# EAGLE schematic FilterSchematic_REV3 (EAGLE 8.2.2)
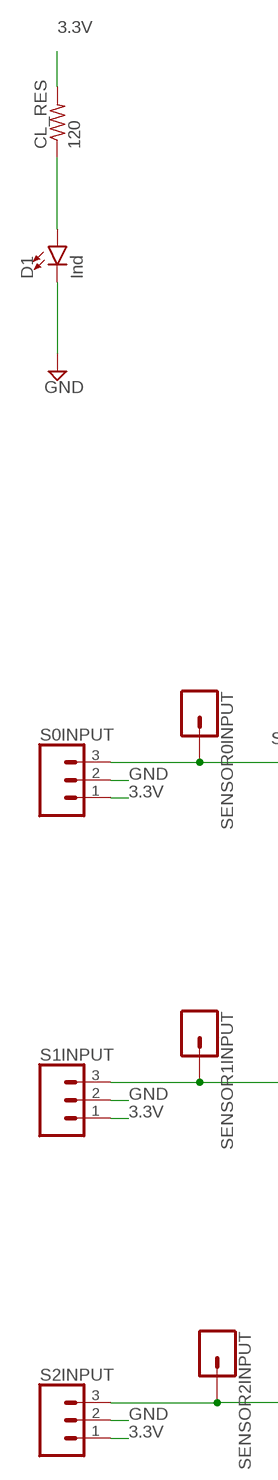
[diagram p0: schematic, sheet 1, part 1 of 2]
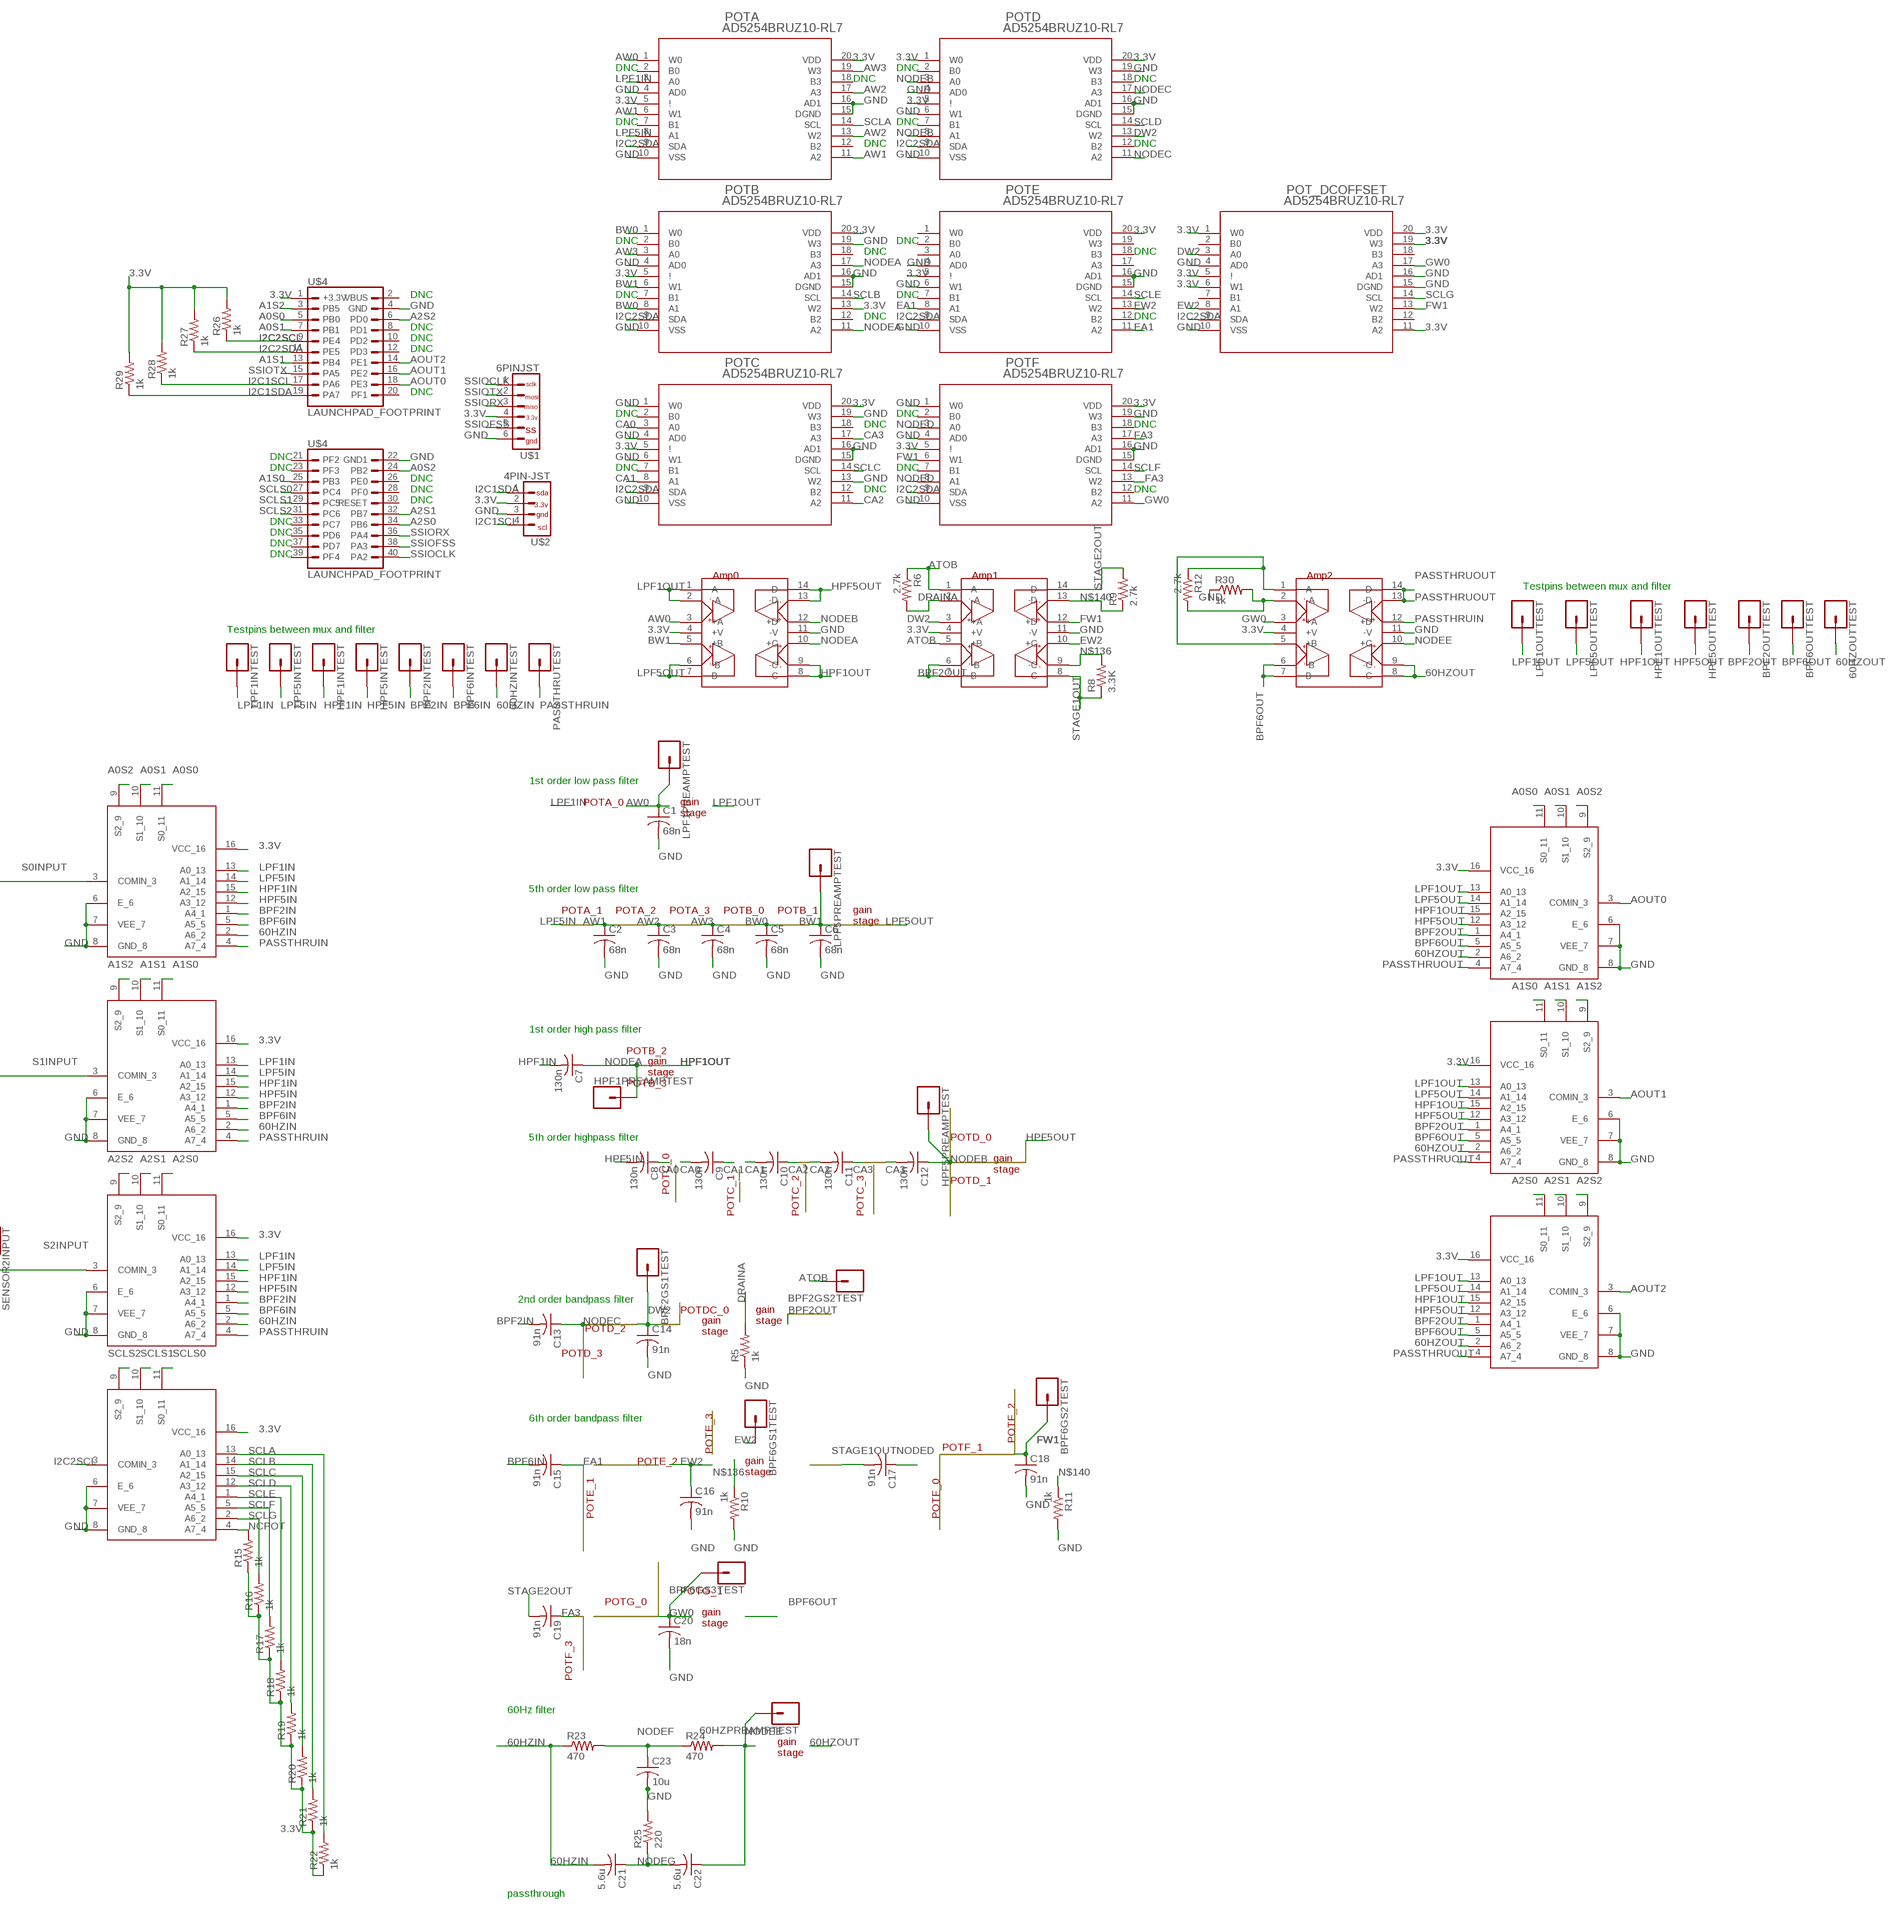
[diagram p1: schematic, sheet 1, part 2 of 2]

## Parts
60HZINTEST  CONN_01  [1X01]
60HZOUTTEST  CONN_01  [1X01]
60HZPREAMPTEST  CONN_01  [1X01]
A2IDEMUX  CD74HC4051-Q1  [TSSOP16]
AI0DEMUX  CD74HC4051-Q1  [TSSOP16]
AI1DEMUX  CD74HC4051-Q1  [TSSOP16]
AMP0  OPA4830  [TSSOP14]
AMP1  OPA4830  [TSSOP14]
AMP2  OPA4830  [TSSOP14]
AO0MUX  CD74HC4051-Q1  [TSSOP16]
AO1MUX  CD74HC4051-Q1  [TSSOP16]
AO2MUX  CD74HC4051-Q1  [TSSOP16]
BPF2GS1TEST  CONN_01  [1X01]
BPF2GS2TEST  CONN_01  [1X01]
BPF2INTEST  CONN_01  [1X01]
BPF2OUTTEST  CONN_01  [1X01]
BPF6GS1TEST  CONN_01  [1X01]
BPF6GS2TEST  CONN_01  [1X01]
BPF6GS3TEST  CONN_01  [1X01]
BPF6INTEST  CONN_01  [1X01]
BPF6OUTTEST  CONN_01  [1X01]
C1  68n  C-USC0805  [C0805]
C2  68n  C-USC0805  [C0805]
C3  68n  C-USC0805  [C0805]
C4  68n  C-USC0805  [C0805]
C5  68n  C-USC0805  [C0805]
C6  68n  C-USC0805  [C0805]
C7  130n  C-USC0805  [C0805]
C8  130n  C-USC0805  [C0805]
C9  130n  C-USC0805  [C0805]
C10  130n  C-USC0805  [C0805]
C11  130n  C-USC0805  [C0805]
C12  130n  C-USC0805  [C0805]
C13  91n  C-USC0805  [C0805]
C14  91n  C-USC0805  [C0805]
C15  91n  C-USC0805  [C0805]
C16  91n  C-USC0805  [C0805]
C17  91n  C-USC0805  [C0805]
C18  91n  C-USC0805  [C0805]
C19  91n  C-USC0805  [C0805]
C20  18n  C-USC0805  [C0805]
C21  5.6u  C-USC0805  [C0805]
C22  5.6u  C-USC0805  [C0805]
C23  10u  C-USC0805  [C0805]
CL_RES  120  R-US_R0805  [R0805]
D1  Ind  LED-GREEN0603  [LED-0603]
HPF1INTEST  CONN_01  [1X01]
HPF1OUTTEST  CONN_01  [1X01]
HPF1PREAMPTEST  CONN_01  [1X01]
HPF5INTEST  CONN_01  [1X01]
HPF5OUTTEST  CONN_01  [1X01]
HPF5PREAMPTEST  CONN_01  [1X01]
LPF1INTEST  CONN_01  [1X01]
LPF1OUTTEST  CONN_01  [1X01]
LPF1PREAMPTEST  CONN_01  [1X01]
LPF5INTEST  CONN_01  [1X01]
LPF5OUTTEST  CONN_01  [1X01]
LPF5PREAMPTEST  CONN_01  [1X01]
PASSTHRUTEST  CONN_01  [1X01]
POT_DCOFFSET  AD5254BRUZ10-RL7  [RU_20]
POTA  AD5254BRUZ10-RL7  [RU_20]
POTB  AD5254BRUZ10-RL7  [RU_20]
POTC  AD5254BRUZ10-RL7  [RU_20]
POTD  AD5254BRUZ10-RL7  [RU_20]
POTE  AD5254BRUZ10-RL7  [RU_20]
POTF  AD5254BRUZ10-RL7  [RU_20]
R5  1k  R-US_R0805  [R0805]
R6  2.7k  R-US_R0805  [R0805]
R8  3.3K  R-US_R0805  [R0805]
R9  2.7k  R-US_R0805  [R0805]
R10  1k  R-US_R0805  [R0805]
R11  1k  R-US_R0805  [R0805]
R12  2.7k  R-US_R0805  [R0805]
R15  1k  R-US_R0805  [R0805]
R16  1k  R-US_R0805  [R0805]
R17  1k  R-US_R0805  [R0805]
R18  1k  R-US_R0805  [R0805]
R19  1k  R-US_R0805  [R0805]
R20  1k  R-US_R0805  [R0805]
R21  1k  R-US_R0805  [R0805]
R22  1k  R-US_R0805  [R0805]
R23  470  R-US_R0805  [R0805]
R24  470  R-US_R0805  [R0805]
R25  220  R-US_R0805  [R0805]
R26  1k  R-US_R0805  [R0805]
R27  1k  R-US_R0805  [R0805]
R28  1k  R-US_R0805  [R0805]
R29  1k  R-US_R0805  [R0805]
R30  1k  R-US_R0805  [R0805]
S0INPUT  CONN_03JST-PTH-VERT  [JST-3-PTH-VERT]
S1INPUT  CONN_03JST-PTH-VERT  [JST-3-PTH-VERT]
S2INPUT  CONN_03JST-PTH-VERT  [JST-3-PTH-VERT]
SCLMUX  CD74HC4051-Q1  [TSSOP16]
SENSOR0INPUT  CONN_01  [1X01]
SENSOR1INPUT  CONN_01  [1X01]
SENSOR2INPUT  CONN_01  [1X01]
U$1  6PINJST  [JST-6-PTH-VERT]
U$2  4PIN-JST  [JST-4-PTH-VERT]
U$4  LAUNCHPAD_FOOTPRINT  [SSW-110-02-S-D]

## Nets
3.3V: A2IDEMUX.16(VCC_16) AI0DEMUX.16(VCC_16) AI1DEMUX.16(VCC_16) AMP0.4(+V) AMP1.4(+V) AMP2.4(+V) AO0MUX.16(VCC_16) AO1MUX.16(VCC_16) AO2MUX.16(VCC_16) CL_RES.2 POT_DCOFFSET.1(W0) POT_DCOFFSET.5(!) POT_DCOFFSET.6(W1) POT_DCOFFSET.11(A2) POT_DCOFFSET.19(W3) POT_DCOFFSET.20(VDD) POTA.5(!) POTA.20(VDD) POTB.5(!) POTB.13(W2) POTB.20(VDD) POTC.5(!) POTC.20(VDD) POTD.1(W0) POTD.5(!) POTD.20(VDD) POTE.5(!) POTE.20(VDD) POTF.5(!) POTF.20(VDD) R15.1 R16.1 R17.1 R18.1 R19.1 R20.1 R21.1 R22.1 R26.2 R27.2 R28.2 R29.2 S0INPUT.1 S1INPUT.1 S2INPUT.1 SCLMUX.16(VCC_16) U$1.4 U$2.2 U$4.1(+3.3V)
60HZIN: 60HZINTEST.1 A2IDEMUX.2(A6_2) AI0DEMUX.2(A6_2) AI1DEMUX.2(A6_2) C21.2 R23.1
60HZOUT: 60HZOUTTEST.1 AMP2.8(C) AMP2.9(-C) AO0MUX.2(A6_2) AO1MUX.2(A6_2) AO2MUX.2(A6_2)
A0S0: AI0DEMUX.11(S0_11) AO0MUX.11(S0_11) U$4.5(PB0)
A0S1: AI0DEMUX.10(S1_10) AO0MUX.10(S1_10) U$4.7(PB1)
A0S2: AI0DEMUX.9(S2_9) AO0MUX.9(S2_9) U$4.24(PB2)
A1S0: AI1DEMUX.11(S0_11) AO1MUX.11(S0_11) U$4.25(PB3)
A1S1: AI1DEMUX.10(S1_10) AO1MUX.10(S1_10) U$4.13(PB4)
A1S2: AI1DEMUX.9(S2_9) AO1MUX.9(S2_9) U$4.3(PB5)
A2S0: A2IDEMUX.11(S0_11) AO2MUX.11(S0_11) U$4.34(PB6)
A2S1: A2IDEMUX.10(S1_10) AO2MUX.10(S1_10) U$4.32(PB7)
A2S2: A2IDEMUX.9(S2_9) AO2MUX.9(S2_9) U$4.6(PD0)
AOUT0: AO0MUX.3(COMIN_3) U$4.18(PE3)
AOUT1: AO1MUX.3(COMIN_3) U$4.16(PE2)
AOUT2: AO2MUX.3(COMIN_3) U$4.14(PE1)
ATOB: AMP1.1(A) AMP1.5(+B) BPF2GS2TEST.1 R6.1
AW0: AMP0.3(+A) C1.1 LPF1PREAMPTEST.1 POTA.1(W0)
AW1: C2.1 POTA.6(W1) POTA.11(A2)
AW2: C3.1 POTA.13(W2) POTA.17(A3)
AW3: C4.1 POTA.19(W3) POTB.3(A0)
BPF2IN: A2IDEMUX.1(A4_1) AI0DEMUX.1(A4_1) AI1DEMUX.1(A4_1) BPF2INTEST.1 C13.2
BPF2OUT: AMP1.6(-B) AMP1.7(B) AO0MUX.1(A4_1) AO1MUX.1(A4_1) AO2MUX.1(A4_1) BPF2OUTTEST.1
BPF6IN: A2IDEMUX.5(A5_5) AI0DEMUX.5(A5_5) AI1DEMUX.5(A5_5) BPF6INTEST.1 C15.2
BPF6OUT: AMP2.6(-B) AMP2.7(B) AO0MUX.5(A5_5) AO1MUX.5(A5_5) AO2MUX.5(A5_5) BPF6OUTTEST.1
BW0: C5.1 POTB.1(W0) POTB.8(A1)
BW1: AMP0.5(+B) C6.1 LPF5PREAMPTEST.1 POTB.6(W1)
CA0: C8.1 C9.2 POTC.3(A0)
CA1: C9.1 C10.2 POTC.8(A1)
CA2: C10.1 C11.2 POTC.11(A2)
CA3: C11.1 C12.2 POTC.17(A3)
DRAINA: AMP1.2(-A) R5.2 R6.2
DW2: AMP1.3(+A) BPF2GS1TEST.1 C14.1 POT_DCOFFSET.3(A0) POTD.13(W2)
EA1: C15.1 POTE.8(A1) POTE.11(A2)
EW2: AMP1.10(+C) BPF6GS1TEST.1 C16.1 POT_DCOFFSET.8(A1) POTE.13(W2)
FA3: C19.1 POTF.13(W2) POTF.17(A3)
FW1: AMP1.12(+D) BPF6GS2TEST.1 C18.1 POT_DCOFFSET.13(W2) POTF.6(W1)
GND: A2IDEMUX.6(E_6) A2IDEMUX.7(VEE_7) A2IDEMUX.8(GND_8) AI0DEMUX.6(E_6) AI0DEMUX.7(VEE_7) AI0DEMUX.8(GND_8) AI1DEMUX.6(E_6) AI1DEMUX.7(VEE_7) AI1DEMUX.8(GND_8) AMP0.11(-V) AMP1.11(-V) AMP2.11(-V) AO0MUX.6(E_6) AO0MUX.7(VEE_7) AO0MUX.8(GND_8) AO1MUX.6(E_6) AO1MUX.7(VEE_7) AO1MUX.8(GND_8) AO2MUX.6(E_6) AO2MUX.7(VEE_7) AO2MUX.8(GND_8) C1.2 C2.2 C3.2 C4.2 C5.2 C6.2 C14.2 C16.2 C18.2 C20.2 C23.2 D1.C POT_DCOFFSET.4(AD0) POT_DCOFFSET.10(VSS) POT_DCOFFSET.15(DGND) POT_DCOFFSET.16(AD1) POTA.4(AD0) POTA.10(VSS) POTA.15(DGND) POTA.16(AD1) POTB.4(AD0) POTB.10(VSS) POTB.15(DGND) POTB.16(AD1) POTB.19(W3) POTC.1(W0) POTC.4(AD0) POTC.6(W1) POTC.10(VSS) POTC.13(W2) POTC.15(DGND) POTC.16(AD1) POTC.19(W3) POTD.4(AD0) POTD.6(W1) POTD.10(VSS) POTD.15(DGND) POTD.16(AD1) POTD.19(W3) POTE.4(AD0) POTE.6(W1) POTE.10(VSS) POTE.15(DGND) POTE.16(AD1) POTF.1(W0) POTF.4(AD0) POTF.10(VSS) POTF.15(DGND) POTF.16(AD1) POTF.19(W3) R5.1 R10.2 R11.2 R25.2 R30.1 S0INPUT.2 S1INPUT.2 S2INPUT.2 SCLMUX.6(E_6) SCLMUX.7(VEE_7) SCLMUX.8(GND_8) U$1.6 U$2.3 U$4.4(GND) U$4.22(GND1)
GW0: AMP2.3(+A) BPF6GS3TEST.1 C20.1 POT_DCOFFSET.17(A3) POTF.11(A2)
HPF1IN: A2IDEMUX.15(A2_15) AI0DEMUX.15(A2_15) AI1DEMUX.15(A2_15) C7.2 HPF1INTEST.1
HPF1OUT: AMP0.8(C) AMP0.9(-C) AO0MUX.15(A2_15) AO1MUX.15(A2_15) AO2MUX.15(A2_15) HPF1OUTTEST.1
HPF5IN: A2IDEMUX.12(A3_12) AI0DEMUX.12(A3_12) AI1DEMUX.12(A3_12) C8.2 HPF5INTEST.1
HPF5OUT: AMP0.13(-D) AMP0.14(D) AO0MUX.12(A3_12) AO1MUX.12(A3_12) AO2MUX.12(A3_12) HPF5OUTTEST.1
I2C1SCL: R28.1 U$2.4 U$4.17(PA6)
I2C1SDA: R29.1 U$2.1 U$4.19(PA7)
I2C2SCL: R26.1 SCLMUX.3(COMIN_3) U$4.9(PE4)
I2C2SDA: POT_DCOFFSET.9(SDA) POTA.9(SDA) POTB.9(SDA) POTC.9(SDA) POTD.9(SDA) POTE.9(SDA) POTF.9(SDA) R27.1 U$4.11(PE5)
LPF1IN: A2IDEMUX.13(A0_13) AI0DEMUX.13(A0_13) AI1DEMUX.13(A0_13) LPF1INTEST.1 POTA.3(A0)
LPF1OUT: AMP0.1(A) AMP0.2(-A) AO0MUX.13(A0_13) AO1MUX.13(A0_13) AO2MUX.13(A0_13) LPF1OUTTEST.1
LPF5IN: A2IDEMUX.14(A1_14) AI0DEMUX.14(A1_14) AI1DEMUX.14(A1_14) LPF5INTEST.1 POTA.8(A1)
LPF5OUT: AMP0.6(-B) AMP0.7(B) AO0MUX.14(A1_14) AO1MUX.14(A1_14) AO2MUX.14(A1_14) LPF5OUTTEST.1
N$1: CL_RES.1 D1.A
N$136: AMP1.9(-C) R8.2 R10.1
N$140: AMP1.13(-D) R9.1 R11.1
N$142: AMP2.1(A) AMP2.5(+B) R12.1
N$143: AMP2.2(-A) R12.2 R30.2
NCPOT: R15.2 SCLMUX.4(A7_4)
NODEA: AMP0.10(+C) C7.1 HPF1PREAMPTEST.1 POTB.11(A2) POTB.17(A3)
NODEB: AMP0.12(+D) C12.1 HPF5PREAMPTEST.1 POTD.3(A0) POTD.8(A1)
NODEC: C13.1 POTD.11(A2) POTD.17(A3)
NODED: C17.1 POTF.3(A0) POTF.8(A1)
NODEE: 60HZPREAMPTEST.1 AMP2.10(+C) C22.1 R24.2
NODEF: C23.1 R23.2 R24.1
NODEG: C21.1 C22.2 R25.1
PASSTHRUIN: A2IDEMUX.4(A7_4) AI0DEMUX.4(A7_4) AI1DEMUX.4(A7_4) AMP2.12(+D) PASSTHRUTEST.1
PASSTHRUOUT: AMP2.13(-D) AMP2.14(D) AO0MUX.4(A7_4) AO1MUX.4(A7_4) AO2MUX.4(A7_4)
S0INPUT: AI0DEMUX.3(COMIN_3) S0INPUT.3 SENSOR0INPUT.1
S1INPUT: AI1DEMUX.3(COMIN_3) S1INPUT.3 SENSOR1INPUT.1
S2INPUT: A2IDEMUX.3(COMIN_3) S2INPUT.3 SENSOR2INPUT.1
SCLA: POTA.14(SCL) R22.2 SCLMUX.13(A0_13)
SCLB: POTB.14(SCL) R21.2 SCLMUX.14(A1_14)
SCLC: POTC.14(SCL) R20.2 SCLMUX.15(A2_15)
SCLD: POTD.14(SCL) R19.2 SCLMUX.12(A3_12)
SCLE: POTE.14(SCL) R18.2 SCLMUX.1(A4_1)
SCLF: POTF.14(SCL) R17.2 SCLMUX.5(A5_5)
SCLG: POT_DCOFFSET.14(SCL) R16.2 SCLMUX.2(A6_2)
SCLS0: SCLMUX.11(S0_11) U$4.27(PC4)
SCLS1: SCLMUX.10(S1_10) U$4.29(PC5)
SCLS2: SCLMUX.9(S2_9) U$4.31(PC6)
SSIOCLK: U$1.1 U$4.40(PA2)
SSIOFSS: U$1.5 U$4.38(PA3)
SSIORX: U$1.3 U$4.36(PA4)
SSIOTX: U$1.2 U$4.15(PA5)
STAGE1OUT: AMP1.8(C) C17.2 R8.1
STAGE2OUT: AMP1.14(D) C19.2 R9.2
Unconnected: POT_DCOFFSET.2(B0) POT_DCOFFSET.7(B1) POT_DCOFFSET.12(B2) POT_DCOFFSET.18(B3) POTA.2(B0) POTA.7(B1) POTA.12(B2) POTA.18(B3) POTB.2(B0) POTB.7(B1) POTB.12(B2) POTB.18(B3) POTC.2(B0) POTC.7(B1) POTC.12(B2) POTC.18(B3) POTD.2(B0) POTD.7(B1) POTD.12(B2) POTD.18(B3) POTE.1(W0) POTE.2(B0) POTE.3(A0) POTE.7(B1) POTE.12(B2) POTE.17(A3) POTE.18(B3) POTE.19(W3) POTF.2(B0) POTF.7(B1) POTF.12(B2) POTF.18(B3) U$4.2(VBUS) U$4.8(PD1) U$4.10(PD2) U$4.12(PD3) U$4.20(PF1) U$4.21(PF2) U$4.23(PF3) U$4.26(PE0) U$4.28(PF0) U$4.30(RESET) U$4.33(PC7) U$4.35(PD6) U$4.37(PD7) U$4.39(PF4)

## Notes on the sheet
- DNC | DNC
- DNC | DNC
- DNC | DNC
- DNC | DNC
- DNC | DNC
- DNC | DNC
- DNC | DNC | DNC
- DNC | DNC
- DNC
- DNC
- DNC
- DNC
- DNC | DNC
- DNC | DNC
- DNC
- DNC | DNC | DNC
- DNC
- DNC | DNC | DNC
- DNC
- DNC
- DNC
- DNC
- DNC
- Amp0 | Amp1 | Amp2
- Testpins between mux and filter
- Testpins between mux and filter
- 1st order low pass filter
- POTA_0
- gain
  stage
- 5th order low pass filter
- POTA_1 | POTA_2 | POTA_3 | POTB_0 | POTB_1
- gain
  stage
- 1st order high pass filter
- POTB_2
- gain
  stage
- POTB_3
- 5th order highpass filter | POTD_0
- gain
  stage
- POTD_1
- POTC_0
- POTC_1 | POTC_2 | POTC_3
- 2nd order bandpass filter
- POTDC_0
- POTD_2
- gain
  stage
- gain
  stage
- POTD_3
- 6th order bandpass filter
- POTF_1 | POTF_2
- POTE_3
- POTE_2
- gain
  stage
- POTE_1 | POTF_0
- POTG_1
- POTG_0
- gain
  stage
- POTF_3
- 60Hz filter
- gain
  stage
- passthrough

## Library data of the parts
60HZINTEST 60HZOUTTEST 60HZPREAMPTEST BPF2GS1TEST BPF2GS2TEST BPF2INTEST BPF2OUTTEST BPF6GS1TEST BPF6GS2TEST BPF6GS3TEST BPF6INTEST BPF6OUTTEST HPF1INTEST HPF1OUTTEST HPF1PREAMPTEST HPF5INTEST HPF5OUTTEST HPF5PREAMPTEST LPF1INTEST LPF1OUTTEST LPF1PREAMPTEST LPF5INTEST LPF5OUTTEST LPF5PREAMPTEST PASSTHRUTEST SENSOR0INPUT SENSOR1INPUT SENSOR2INPUT = SparkFun-Connectors:CONN_01: Single connection point. Often used as Generic Header-pin footprint for 0.1 inch spaced/style header connections On any of the 0.1 inch spaced packages, you can populate with these: Break Away Headers - Straight <https://www.sparkfun.com/products/116> (PRT-00116) Break Away Male Headers - Right Angle <https://www.sparkfun.com/products/553> (PRT-00553) Female Headers <https://www.sparkfun.com/products/115> (PRT-00115) Break Away Headers - Machine Pin <https://www.sparkfun.com/products/117> (PRT-00117) Break Away Female Headers - Swiss Machine Pin <https://www.sparkfun.com/products/743> (PRT-00743) This device is also useful as a general connection point to wire up your design to another part of your project. Our various solder wires solder well into these plated through hole pads. Hook-Up Wire - Assortment (Stranded, 22 AWG) <https://www.sparkfun.com/products/11375> (PRT-11375) Hook-Up Wire - Assortment (Solid Core, 22 AWG) <https://www.sparkfun.com/products/11367> (PRT-11367) View the entire wire category on our website here <https://www.sparkfun.com/categories/141> Special notes: SMTSO-256-ET is a "flush mount" nut for a 4-40 screw. We mostly use this on specialty testbeds; it is a nice way to connect hardware to your PCB at an adjustable hieght. Also note, the SNAP packages are for using a snappable style connector. We sell a baggie of snaps and they are also used on two LilyPad designs: Snap Assortment - 30 pack (male and female) <https://www.sparkfun.com/products/11347> (DEV-11347) LilyPad Arduino SimpleSnap <https://www.sparkfun.com/products/10941> (DEV-10941) LilyPad SimpleSnap Protoboard <https://www.sparkfun.com/products/10940> (DEV-10940)
A2IDEMUX AI0DEMUX AI1DEMUX AO0MUX AO1MUX AO2MUX SCLMUX = 491Library:CD74HC4051-Q1
AMP0 AMP1 AMP2 = 491Library:OPA4830
C1-C23 = rcl:C-US: CAPACITOR, American symbol
CL_RES R5 R6 R8-R12 R15-R30 = rcl:R-US_: RESISTOR, American symbol
D1 = SparkFun-LED:LED-GREEN: Green SMD LED Used in manufacturing of various products at SparkFun Packages: 0603 - SMD 0603 package [Product Link] <http://www.futureelectronics.com/en/technologies/semiconductors/optoelectronics/leds/Pages/9894312-LTST-C190GKT.aspx?CrossPart=HSMG-C190&IM=0> LilyPad 1206 - SMD1206 LilyPad package [Product Link] <http://www.futureelectronics.com/en/Technologies/Product.aspx?ProductID=IN150NGHARVATEKCORPORATION2049943&IM=0> 1206 - SMD1206 package [Product Link] <http://www.futureelectronics.com/en/technologies/semiconductors/optoelectronics/leds/Pages/8315665-LTST-C150KGKT.aspx?IM=0> 1206 Bottom Mount -SMD 1206 Bottom Mount [Product Link] <http://www.digikey.com/product-detail/en/lite-on-inc/LTST-C230KGKT/160-1456-1-ND/386854> SparkFun Products: Pro Mini 328 -5V <https://www.sparkfun.com/products/821> RedBoard <https://www.sparkfun.com/products/12757> MP3 Trigger <https://www.sparkfun.com/products/13720> Makey Makey <https://www.sparkfun.com/products/11076>; PROD_ID: DIO-00821; VALUE: GREEN
POT_DCOFFSET POTA POTB POTC POTD POTE POTF = 491Library:AD5254BRUZ10-RL7; MANUFACTURER_PART_NUMBER: AD5254BRUZ10RL7; VENDOR: Analog Devices Inc
S0INPUT S1INPUT S2INPUT = SparkFun-Connectors:CONN_03: Multi connection point. Often used as Generic Header-pin footprint for 0.1 inch spaced/style header connections On any of the 0.1 inch spaced packages, you can populate with these: Break Away Headers - Straight <https://www.sparkfun.com/products/116> (PRT-00116) Break Away Male Headers - Right Angle <https://www.sparkfun.com/products/553> (PRT-00553) Female Headers <https://www.sparkfun.com/products/115> (PRT-00115) Break Away Headers - Machine Pin <https://www.sparkfun.com/products/117> (PRT-00117) Break Away Female Headers - Swiss Machine Pin <https://www.sparkfun.com/products/743> (PRT-00743) Stackable Header - 3 Pin (Female, 0.1") <https://www.sparkfun.com/products/13875> (PRT-13875) For SCREWTERMINALS and SPRING TERMINALS visit here: Screw Terimnals on SparkFun.com <https://www.sparkfun.com/search/results?term=Screw+Terminals> (5mm/3.5mm/2.54mm spacing) This device is also useful as a general connection point to wire up your design to another part of your project. Our various solder wires solder well into these plated through hole pads. Hook-Up Wire - Assortment (Stranded, 22 AWG) <https://www.sparkfun.com/products/11375> (PRT-11375) Hook-Up Wire - Assortment (Solid Core, 22 AWG) <https://www.sparkfun.com/products/11367> (PRT-11367) View the entire wire category on our website here <https://www.sparkfun.com/categories/141> Special notes: Molex polarized connector foot print use with SKU : PRT-08232 with associated crimp pins and housings.; PROD_ID: CONN-13230
U$1 = 491Library:6PINJST
U$2 = 491Library:4PIN-JST
U$4 = 491Library:LAUNCHPAD_FOOTPRINT